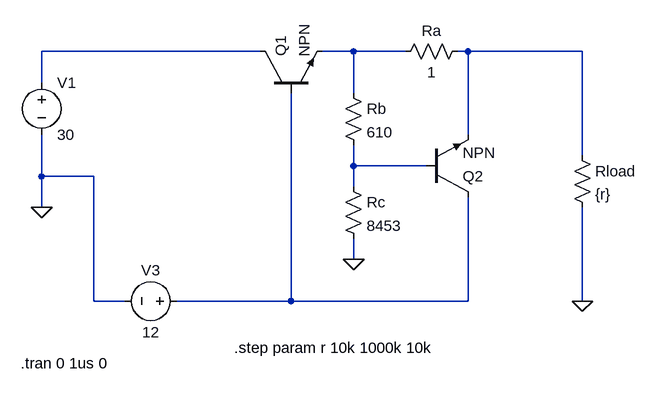
[diagram p0: schematic foldback.asc]
foldback.asc, the LTspice schematic file:
Version 4
SHEET 1 880 680
WIRE 128 -32 -208 -32
WIRE 272 -32 224 -32
WIRE 352 -32 272 -32
WIRE 448 -32 432 -32
WIRE 624 -32 448 -32
WIRE -208 16 -208 -32
WIRE 272 32 272 -32
WIRE 448 96 448 -32
WIRE 624 128 624 -32
WIRE 272 144 272 112
WIRE 384 144 272 144
WIRE -208 160 -208 96
WIRE -128 160 -208 160
WIRE 272 176 272 144
WIRE -208 208 -208 160
WIRE 272 288 272 256
WIRE -128 352 -128 160
WIRE -80 352 -128 352
WIRE 176 352 176 32
WIRE 176 352 0 352
WIRE 448 352 448 192
WIRE 448 352 176 352
WIRE 624 352 624 208
FLAG 272 288 0
FLAG -208 208 0
FLAG 624 352 0
SYMBOL npn 128 32 R270
SYMATTR InstName Q1
SYMBOL npn 384 192 M180
SYMATTR InstName Q2
SYMBOL res 256 16 R0
SYMATTR InstName Rb
SYMATTR Value 610
SYMBOL res 256 160 R0
SYMATTR InstName Rc
SYMATTR Value 8453
SYMBOL res 448 -48 R90
WINDOW 0 0 56 VBottom 2
WINDOW 3 32 56 VTop 2
SYMATTR InstName Ra
SYMATTR Value 1
SYMBOL voltage -208 0 R0
WINDOW 123 0 0 Left 0
WINDOW 39 0 0 Left 0
SYMATTR InstName V1
SYMATTR Value 30
SYMBOL voltage 16 352 R90
WINDOW 0 -32 56 VBottom 2
WINDOW 3 32 56 VTop 2
WINDOW 123 0 0 Left 0
WINDOW 39 0 0 Left 0
SYMATTR InstName V3
SYMATTR Value 12
SYMBOL res 608 112 R0
SYMATTR InstName Rload
SYMATTR Value {r}
TEXT 88 424 Left 2 !.step param r 10k 1000k 10k
TEXT -240 448 Left 2 !.tran 0 1us 0

The netlist it stands for:
* foldback.asc
Q1 N001 N005 N002 0 NPN
Q2 N005 N004 N003 0 NPN
Rb N002 N004 610
Rc N004 0 8453
Ra N003 N002 1
V1 N001 0 30
V3 N005 0 12
Rload N003 0 {r}
.model NPN NPN
.model PNP PNP
.lib standard.bjt
.step param r 10k 1000k 10k
.tran 0 1us 0
.backanno
.end